# Altium schematic sheet Sensors.SchDoc
size A4; SheetNumber: 3; SheetTotal: 7
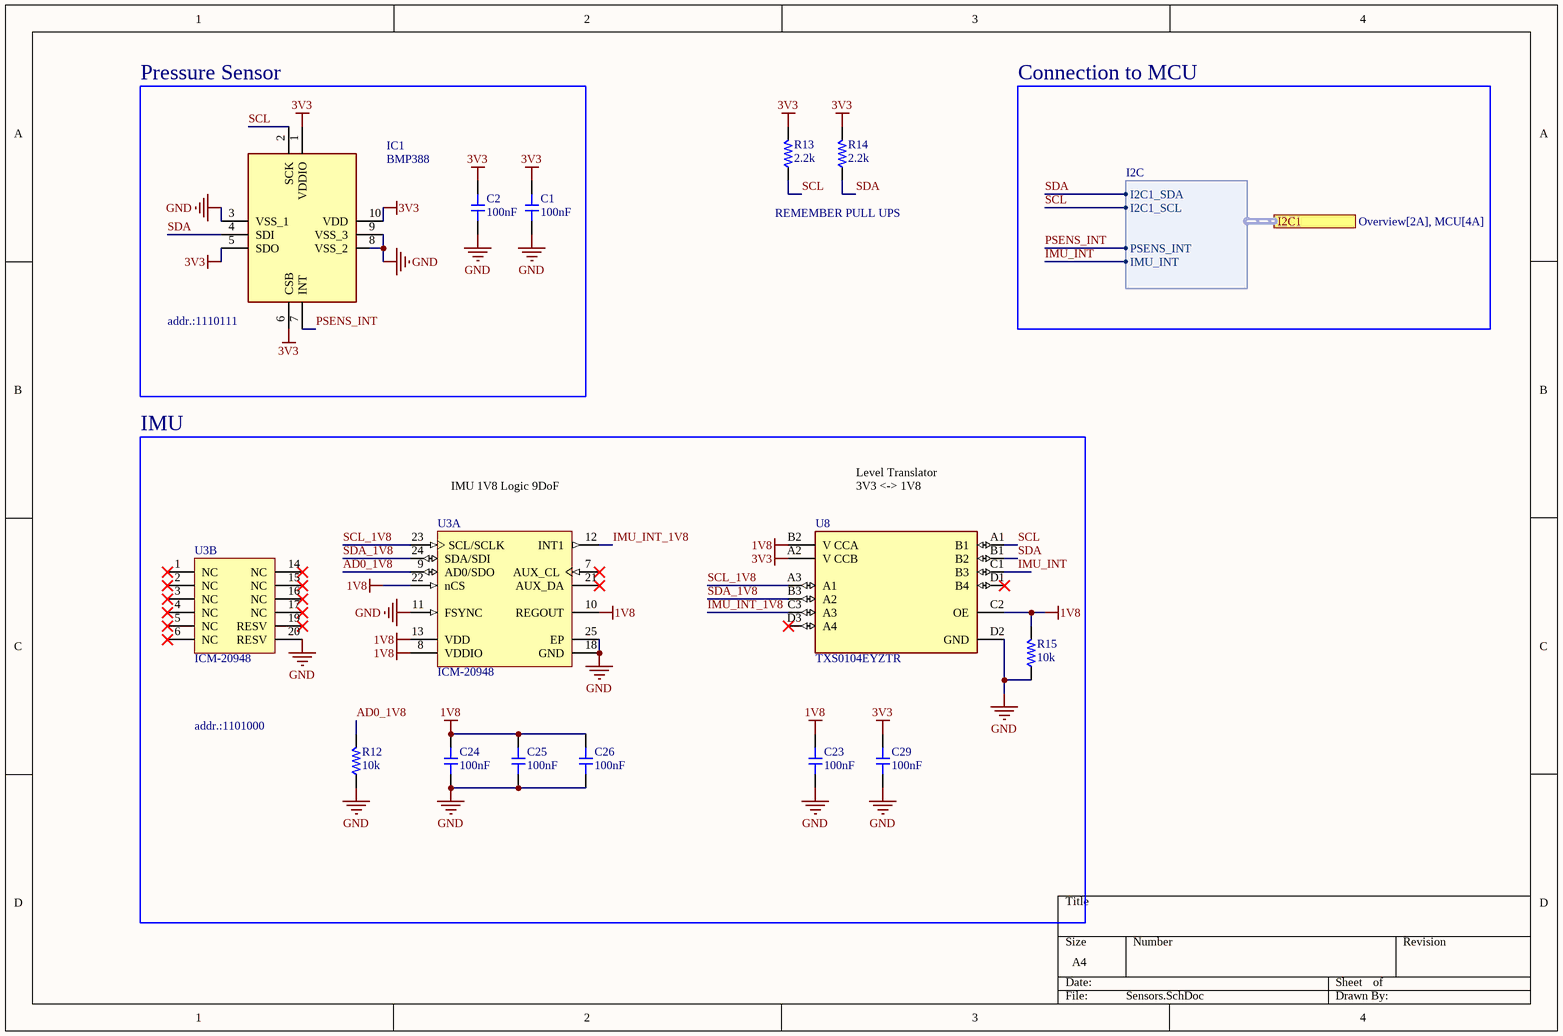
[diagram p0: Sensors.SchDoc]

## Parts
C1  value 100nF  [CAP-0402]  (hidden comment: CL05B104KO5NNNC)
C2  value 100nF  [CAP-0402]  (hidden comment: CL05B104KO5NNNC)
C23  value 100nF  [CAP-0402]  (hidden comment: CL05B104KO5NNNC)
C24  value 100nF  [CAP-0402]  (hidden comment: CL05B104KO5NNNC)
C25  value 100nF  [CAP-0402]  (hidden comment: CL05B104KO5NNNC)
C26  value 100nF  [CAP-0402]  (hidden comment: CL05B104KO5NNNC)
C29  value 100nF  [CAP-0402]  (hidden comment: CL05B104KO5NNNC)
IC1  BMP388  [BMP388]
R12  value 10k  [RES-0402]  (hidden comment: 0402WGF1002TCE)
R13  value 2.2k  [RES-0402]  (hidden comment: 0402WGF2201TCE)
R14  value 2.2k  [RES-0402]  (hidden comment: 0402WGF2201TCE)
R15  value 10k  [RES-0402]  (hidden comment: 0402WGF1002TCE)
U3  ICM-20948  [TDK-QFN-24_L]  (parts A,B of 2)
U8  TXS0104EYZTR  [FP-YZT0012A-IPC_C]

## Blocks framed on the sheet
Pressure Sensor: C1 C2 IC1
IMU: C23-C26 C29 R12 R15 U3 U8

## Ports
I2C1 (harness I2C, see Overview[2A], MCU[4A])

## Harnesses
I2C: I2C1_SDA, I2C1_SCL, PSENS_INT, IMU_INT

## Nets
1V8: C23.2 C24.2 C25.2 C26.2 R15.2 U3.8(VDDIO) U3.10(REGOUT) U3.13(VDD) U3.22(nCS) U8.B2(V_CCA) U8.C2(OE)
3V3: C1.2 C2.2 C29.2 IC1.1(VDDIO) IC1.5(SDO) IC1.6(CSB) IC1.10(VDD) R13.2 R14.2 U8.A2(V_CCB)
GND: C1.1 C2.1 C23.1 C24.1 C25.1 C26.1 C29.1 IC1.3(VSS_1) IC1.8(VSS_2) IC1.9(VSS_3) R12.1 R15.1 U3.11(FSYNC) U3.18(GND) U3.20(RESV) U3.25(EP) U8.D2(GND)
AD0_1V8: R12.2 U3.9(AD0/SDO)
IMU_INT: U8.C1(B3) ; port I2C1.IMU_INT
IMU_INT_1V8: U3.12(INT1) U8.C3(A3)
PSENS_INT: IC1.7(INT) ; port I2C1.PSENS_INT
SCL: IC1.2(SCK) R13.1 U8.A1(B1) ; port I2C1.I2C1_SCL
SCL_1V8: U3.23(SCL/SCLK) U8.A3(A1)
SDA: IC1.4(SDI) R14.1 U8.B1(B2) ; port I2C1.I2C1_SDA
SDA_1V8: U3.24(SDA/SDI) U8.B3(A2)

Not connected (* = marked no-connect by the designer): U3 1(NC)* 2(NC)* 3(NC)* 4(NC)* 5(NC)* 6(NC)* 7(AUX_CL)* 14(NC)* 15(NC)* 16(NC)* 17(NC)* 19(RESV)* 21(AUX_DA)*; U8 D1(B4)* D3(A4)*

## Notes on the sheet
- Connection to MCU
- REMEMBER PULL UPS
- (near IC1) addr.:1110111
- (near U3) IMU 1V8 Logic 9DoF
- Level Translator
  3V3 <-> 1V8
- addr.:1101000

## Library data of the parts
C1 C2 C23-C26 C29 = CMP-001-00142-1: Capacitor, Ceramic (MLCC), 100nF, ±10%, 16V, X7R, ±10%, SMD 0402; Manufacturer: Samsung Electro-Mechanics; Design Item ID: CL05B104KO5NNNC; Source: jlcpcb_capacitors_basic.schlib; ComponentLink2URL: https://jlcpcb.com/partdetail/C1525; Voltage Rating: 16V; Tolerance: 10%; Temperature Coefficient: X7R; ComponentLink2Description: JLCPCB Part URL; ComponentLink1URL: https://datasheet.lcsc.com/lcsc/1810191219_Samsung-Electro-Mechanics-CL05B104KO5NNNC_C1525.pdf; JLCPCB Basic Part: Yes; JLCPCB Part Number: C1525; ComponentLink3URL: https://lcsc.com/product-detail/Multilayer-Ceramic-Capacitors-MLCC---SMD-SMT_Samsung-Electro-Mechanics-Samsung-Electro-Mechanics-CL05B104KO5NNNC_C1525.html; Manufacturer Part Number: CL05B104KO5NNNC; ComponentLink1Description: Datasheet; Case/Package: 0402; RoHS: Yes; Category: Capacitors - MLCC; ComponentLink3Description: LCSC Part URL
IC1 = CMP-004-000000-3: Pressure Sensor 30kPa to 125kPa Absolute 10-Pin LGA; Manufacturer_Name: Bosch Sensortec; Design Item ID: BMP388; Manufacturer_Part_Number: BMP388; Datasheet Link: https://www.bosch-sensortec.com/media/boschsensortec/downloads/datasheets/bst-bmp388-ds001.pdf; Source: SamacSys.SchLib; Height: 1mm; LCSC PART #: C779278
R12 R15 = CMP-009-00191-1: Resistor, 10kΩ, ±1%, 62.5mW, 50V, ±100ppm/℃, -55℃~+155℃, SMD 0402; Manufacturer: Uniroyal; Temperature Rating: -55℃~+155℃; ComponentLink1URL: https://datasheet.lcsc.com/lcsc/2206010100_UNI-ROYAL-Uniroyal-Elec-0402WGF1002TCE_C25744.pdf; Source: jlcpcb_resistors_basic.schlib; Tolerance: 1%; Design Item ID: 0402WGF1002TCE; ComponentLink1Description: Datasheet; ComponentLink2URL: https://jlcpcb.com/partdetail/C25744; Category: Resistors; JLCPCB Part Number: C25744; ComponentLink2Description: JLCPCB Part URL; Temperature Coefficient: ±100ppm/℃; JLCPCB Basic Part: Yes; Power Rating: 62.5mW; Case/Package: 0402; Voltage Rating: 50V; Manufacturer Part Number: 0402WGF1002TCE
R13 R14 = CMP-009-00211-1: Resistor, 2.2kΩ, ±1%, 62.5mW, 50V, ±100ppm/℃, -55℃~+155℃, SMD 0402; Manufacturer: Uniroyal; Source: jlcpcb_resistors_basic.schlib; JLCPCB Basic Part: Yes; Case/Package: 0402; Category: Resistors; Voltage Rating: 50V; Temperature Rating: -55℃~+155℃; ComponentLink1URL: https://datasheet.lcsc.com/lcsc/2206010045_UNI-ROYAL-Uniroyal-Elec-0402WGF2201TCE_C25879.pdf; Manufacturer Part Number: 0402WGF2201TCE; Tolerance: 1%; Power Rating: 62.5mW; Temperature Coefficient: ±100ppm/℃; ComponentLink2URL: https://jlcpcb.com/partdetail/C25879; ComponentLink1Description: Datasheet; ComponentLink2Description: JLCPCB Part URL; Design Item ID: 0402WGF2201TCE; JLCPCB Part Number: C25879
U3 = CMP-010-00033-1: 9-Axis MEMS MotionTracking Device Gyroscope/Accelerometer/Compass Digital Motion Processor 24-Pin QFN; JLCPCB Part Number: C726001
U8 = CMP-016-00011-1: Interface Circuit, PBGA12; Nominal Supply Voltage: 1.8V; Min Supply Voltage: 1.65V; Max Supply Voltage: 3.6V; Max Operating Temperature: 85°C; Min Operating Temperature: -40°C; Case/Package: DSBGA; Pins: 12; JLCPCB Part Number: C478473; RoHS Compliant: Yes